# Altium schematic sheet LEDs.SchDoc
size A; SheetNumber: 9
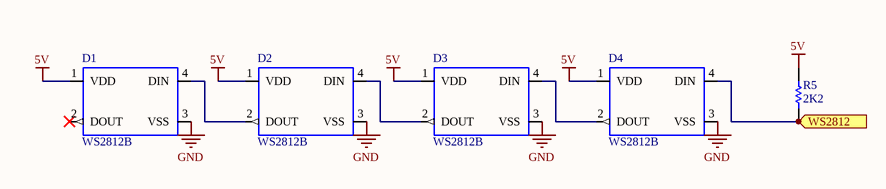
[diagram p0: LEDs.SchDoc]

## Parts
D1  WS2812B  [WS2812B]
D2  WS2812B  [WS2812B]
D3  WS2812B  [WS2812B]
D4  WS2812B  [WS2812B]
R5  value 2K2  [R0402[1005]]  (hidden comment: 2K2 1% 0402)

## Ports
WS2812 (in)

## Nets
5V: D1.1(VDD) D2.1(VDD) D3.1(VDD) D4.1(VDD) R5.2
GND: D1.3(VSS) D2.3(VSS) D3.3(VSS) D4.3(VSS)
WS2812: D4.4(DIN) R5.1 ; port WS2812
NetD1_4: D1.4(DIN) D2.2(DOUT)
NetD2_4: D2.4(DIN) D3.2(DOUT)
NetD3_4: D3.4(DIN) D4.2(DOUT)

Not connected (* = marked no-connect by the designer): D1 2(DOUT)*

## Library data of the parts
R5 = RES_2K2_0402_1%: 2K2 0.063W 1% 0402 (1005 Metric); Manufacturer: KOA Speer; PartNumber: RK73H1ETTP2201F; Tolerance: 1%; Power: 0.063W; Mounting Technology: Surface Mount; PackageReference: 0402; PackageDescription: 0402 (1005 Metric); ComponentLink1Description: Datasheet; ComponentLink1URL: http://www.koaspeer.com/catimages/Products/RK73H/RK73H.pdf
D1-D4 = WS2812B: PartNumber: WS2812B